# EAGLE design PiCamHDMIExpander (EAGLE 8.3.1)
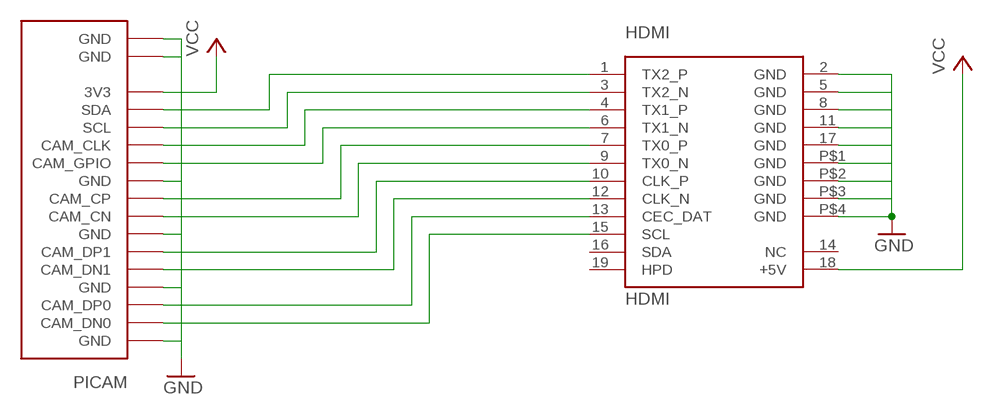
[diagram p0: schematic, sheet 1]

## Parts
HDMI  HDMI  [HDMI]
PICAM  RASPI_CAM  [FFC-15]

## Nets
GND: HDMI.2(GND) HDMI.5(GND) HDMI.8(GND) HDMI.11(GND) HDMI.17(GND) HDMI.P$1(GND) HDMI.P$2(GND) HDMI.P$3(GND) HDMI.P$4(GND) PICAM.P$1(GND) PICAM.P$4(GND) PICAM.P$7(GND) PICAM.P$10(GND) PICAM.P$16(GND) PICAM.P$17(GND)
N$1: HDMI.4(TX1_P) PICAM.P$12(CAM_CLK)
N$2: HDMI.12(CLK_N) PICAM.P$5(CAM_DN1)
N$3: HDMI.10(CLK_P) PICAM.P$6(CAM_DP1)
N$4: HDMI.9(TX0_N) PICAM.P$8(CAM_CN)
N$5: HDMI.1(TX2_P) PICAM.P$14(SDA)
N$6: HDMI.7(TX0_P) PICAM.P$9(CAM_CP)
N$7: HDMI.6(TX1_N) PICAM.P$11(CAM_GPIO)
N$8: HDMI.3(TX2_N) PICAM.P$13(SCL)
N$9: HDMI.13(CEC_DAT) PICAM.P$3(CAM_DP0)
N$10: HDMI.15(SCL) PICAM.P$2(CAM_DN0)
VCC: HDMI.18(+5V) PICAM.P$15(3V3)
Unconnected: HDMI.14(NC) HDMI.16(SDA) HDMI.19(HPD)

## Library data of the parts
HDMI = raspberrypi_cm:HDMI
PICAM = raspberrypi_cm:RASPI_CAM: Raspberry Pi camera connector www.hasseb.fi

## Board
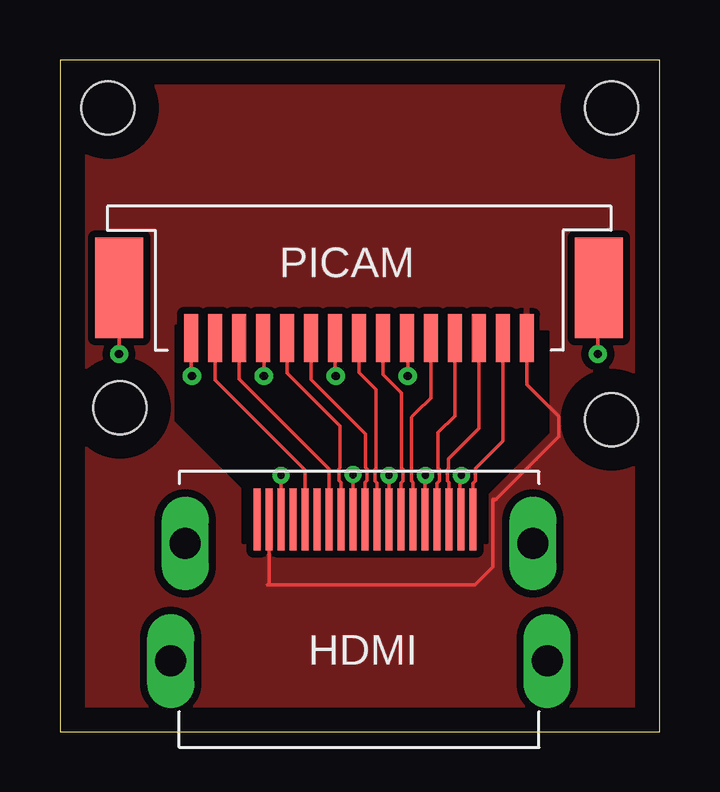
[diagram p1: board, top side]
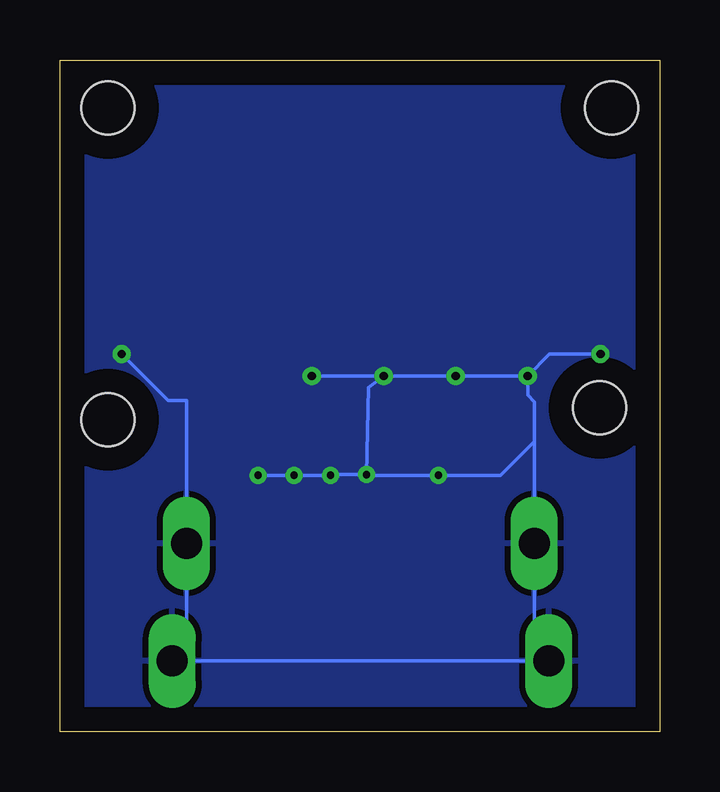
[diagram p2: board, bottom side, seen from below]

Size 25 x 28 mm. Coordinates in mm from the lower left corner, seen from the top.
Outline: 0,0 25,0 25,28 0,28 0,0
Copper layers (1*16): Top 0.035mm / dielectric 1.5mm / Bottom 0.035mm
Design rules "default *": minimum track width 6mil, minimum drill 0.3mm, track to track 6mil, track to pad 6mil, pad to pad 6mil, via to via 6mil, smd to smd 6mil, copper to edge 40mil, drill to drill 6mil, minimum pad ring 10mil, minimum via ring 8mil, stop-mask expansion 4mil, vias tented up to drill 0mil, thermal gap 10mil
Holes 2.2 mm at 2,26 23,26 2.5,13.5 23,13

### Footprints (pad centres in the part's own frame; a part is rotated, then mirrored left to right if it is on the bottom)
HDMI = smd 0.3 x 2.6: 1 4.75,4; 2 4.25,4; 3 3.75,4; 4 3.25,4; 5 2.75,4; 6 2.25,4; 7 1.75,4; 8 1.25,4; 9 0.75,4; 10 0.25,4; 11 -0.25,4; 12 -0.75,4; 13 -1.25,4; 14 -1.75,4; 15 -2.25,4; 16 -2.75,4; 17 -3.25,4; 18 -3.75,4; 19 -4.25,4 | drill 1.3 long: P$1 7.25,3; P$2 -7.25,3; P$3 -7.85,-1.9; P$4 7.85,-1.9
FFC-15 = smd 0.6 x 2: P$1 7,0; P$2 6,0; P$3 5,0; P$4 4,0; P$5 3,0; P$6 2,0; P$7 1,0; P$8 0,0; P$9 -1,0; P$10 -2,0; P$11 -3,0; P$12 -4,0; P$13 -5,0; P$14 -6,0; P$15 -7,0 | smd 2 x 4.2: P$16 -10,-2.1; P$17 10,-2.1

### Placement (x,y rotation side)
HDMI  12.47,4.84 0 top
PICAM  12.47,16.4 180 top

### Tracks (layer width: path | path; a pad name or v marks a point on that pad's centre or on a via)
GND  (via drill 0.3, 0.3 pad 0.55, 0.35)
  Top 0.152: PICAM.P$1 5.47,14.98 v5.5,14.82 | v8.5,14.82 8.5,16.37 PICAM.P$4 | PICAM.P$7 11.47,14.98 v11.5,14.82 | v14.5,14.82 14.5,16.37 PICAM.P$10 | HDMI.17 9.22,10.56 v9.22,10.68 | HDMI.11 12.22,10.58 v12.22,10.71 | HDMI.8 13.72,10.55 v13.71,10.68 | HDMI.5 15.22,10.54 v15.24,10.68 | HDMI.2 16.68,10.54 v16.74,10.68 | v22.43,15.74 22.43,18.46 PICAM.P$16 | v2.46,15.74 PICAM.P$17
  Bottom 0.152: 5.47,14.85 v5.5,14.82 | v5.5,14.82 v8.5,14.82 v11.5,14.82 | v11.5,14.82 v14.5,14.82 | v11.5,14.82 12.13,14.35 v12.22,10.71 | v12.22,10.71 12.19,10.68 v9.22,10.68 6.63,10.68 5.22,12.1 | v12.22,10.71 13.69,10.71 v13.71,10.68 v15.24,10.68 v16.74,10.68 | 5.22,12.1 5.22,13.74 5.5,14.02 v5.5,14.82 | 5.22,12.1 HDMI.P$2 5.22,3.54 HDMI.P$3 HDMI.P$4 19.72,3.54 HDMI.P$1 19.72,13.79 20.48,13.79 v22.43,15.74 | v2.46,15.74 4.58,15.74 v5.5,14.82
  pour Bottom: 0,27.94 0,-0.13 25.15,-0.13 25.15,27.94
N$1
  Top 0.152: PICAM.P$12 16.47,13.16 15.77,12.46 15.77,10.97 15.82,10.93 15.82,10.44 15.72,10.34 HDMI.4
N$2
  Top 0.152: PICAM.P$5 9.47,14.95 11.68,12.74 11.68,11 11.63,10.95 11.63,10.47 11.72,10.38 HDMI.12
N$3
  Top 0.152: HDMI.10 12.72,10.39 12.8,10.47 12.8,10.95 12.75,11 12.75,12.4 10.47,14.68 PICAM.P$6
N$4
  Top 0.152: PICAM.P$8 12.47,14.96 13.18,14.25 13.18,10.97 13.13,10.93 13.13,10.44 13.22,10.36 HDMI.9
N$5
  Top 0.152: PICAM.P$14 18.47,12.11 17.32,10.96 17.32,10.44 17.22,10.34 HDMI.1
N$6
  Top 0.152: PICAM.P$9 13.47,14.89 14.25,14.12 14.25,10.97 14.3,10.93 14.3,10.44 14.22,10.37 HDMI.7
N$7
  Top 0.152: PICAM.P$11 15.47,13.91 14.85,13.29 14.71,13.15 14.66,13.1 14.66,10.44 14.72,10.38 HDMI.6
N$8
  Top 0.152: PICAM.P$13 17.47,12.64 16.2,11.37 16.2,10.97 16.16,10.93 16.16,10.44 16.22,10.38 HDMI.3
N$9
  Top 0.152: HDMI.13 11.22,10.94 7.47,14.69 PICAM.P$3
N$10
  Top 0.152: PICAM.P$2 6.47,14.65 10.22,10.9 HDMI.15
N$11
  cutout Top: 4.85,16.91 4.85,12.97 7.64,10.18 7.64,7.89 17.8,7.89 17.8,9.92 20.34,12.46 20.34,16.65
VCC
  Top 0.152: HDMI.18 8.72,6.17 8.66,6.11 17.3,6.11 18.06,6.87 18.06,9.67 18.18,9.67 20.81,12.3 20.81,13.14 19.47,14.48 PICAM.P$15
  pour Top (isolate 0.305): 0,27.94 0,-0.13 25.15,-0.13 25.15,27.94